# Altium schematic sheet GMSL_SERIALIZER.SchDoc
size C; SheetNumber: 18; SheetTotal: 19
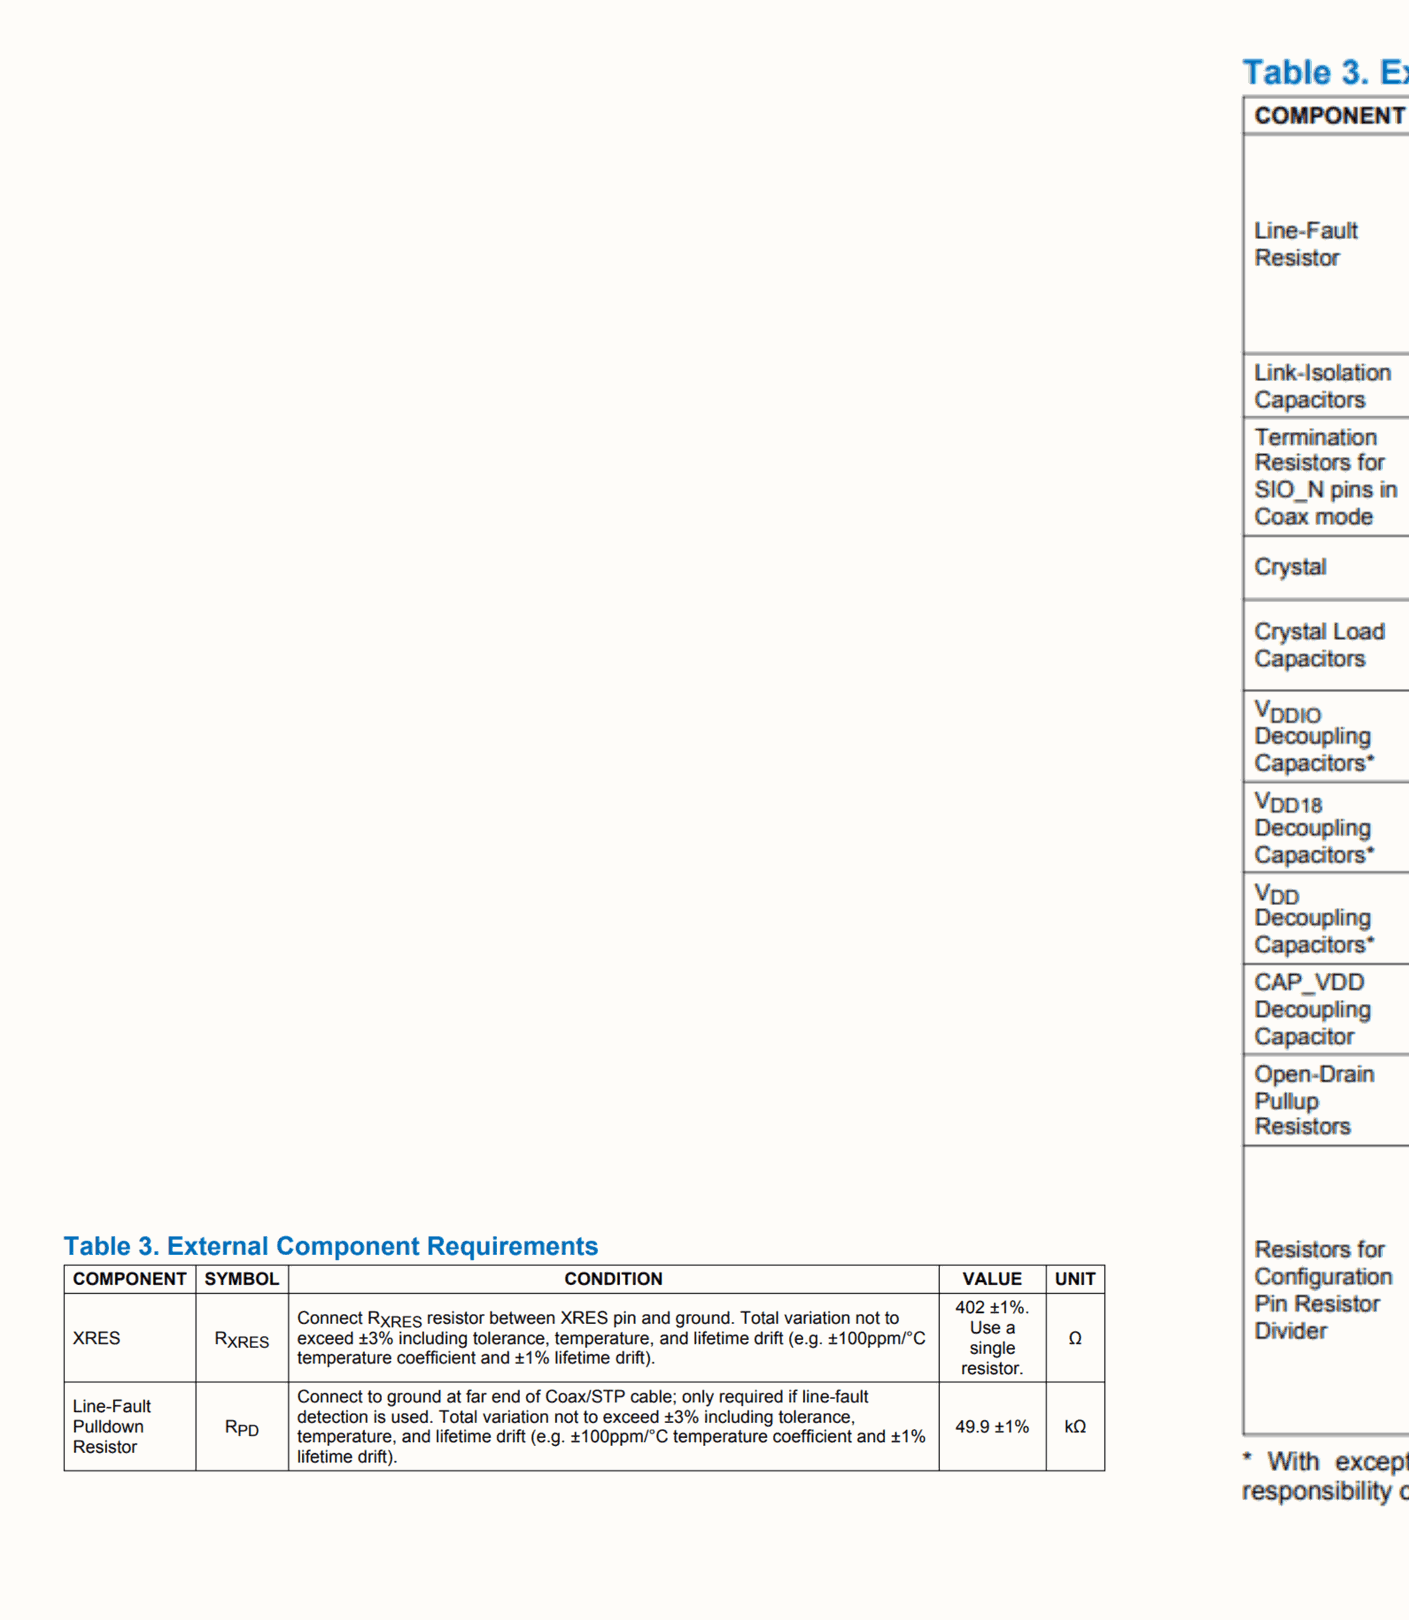
[diagram p0: GMSL_SERIALIZER.SchDoc, top left]
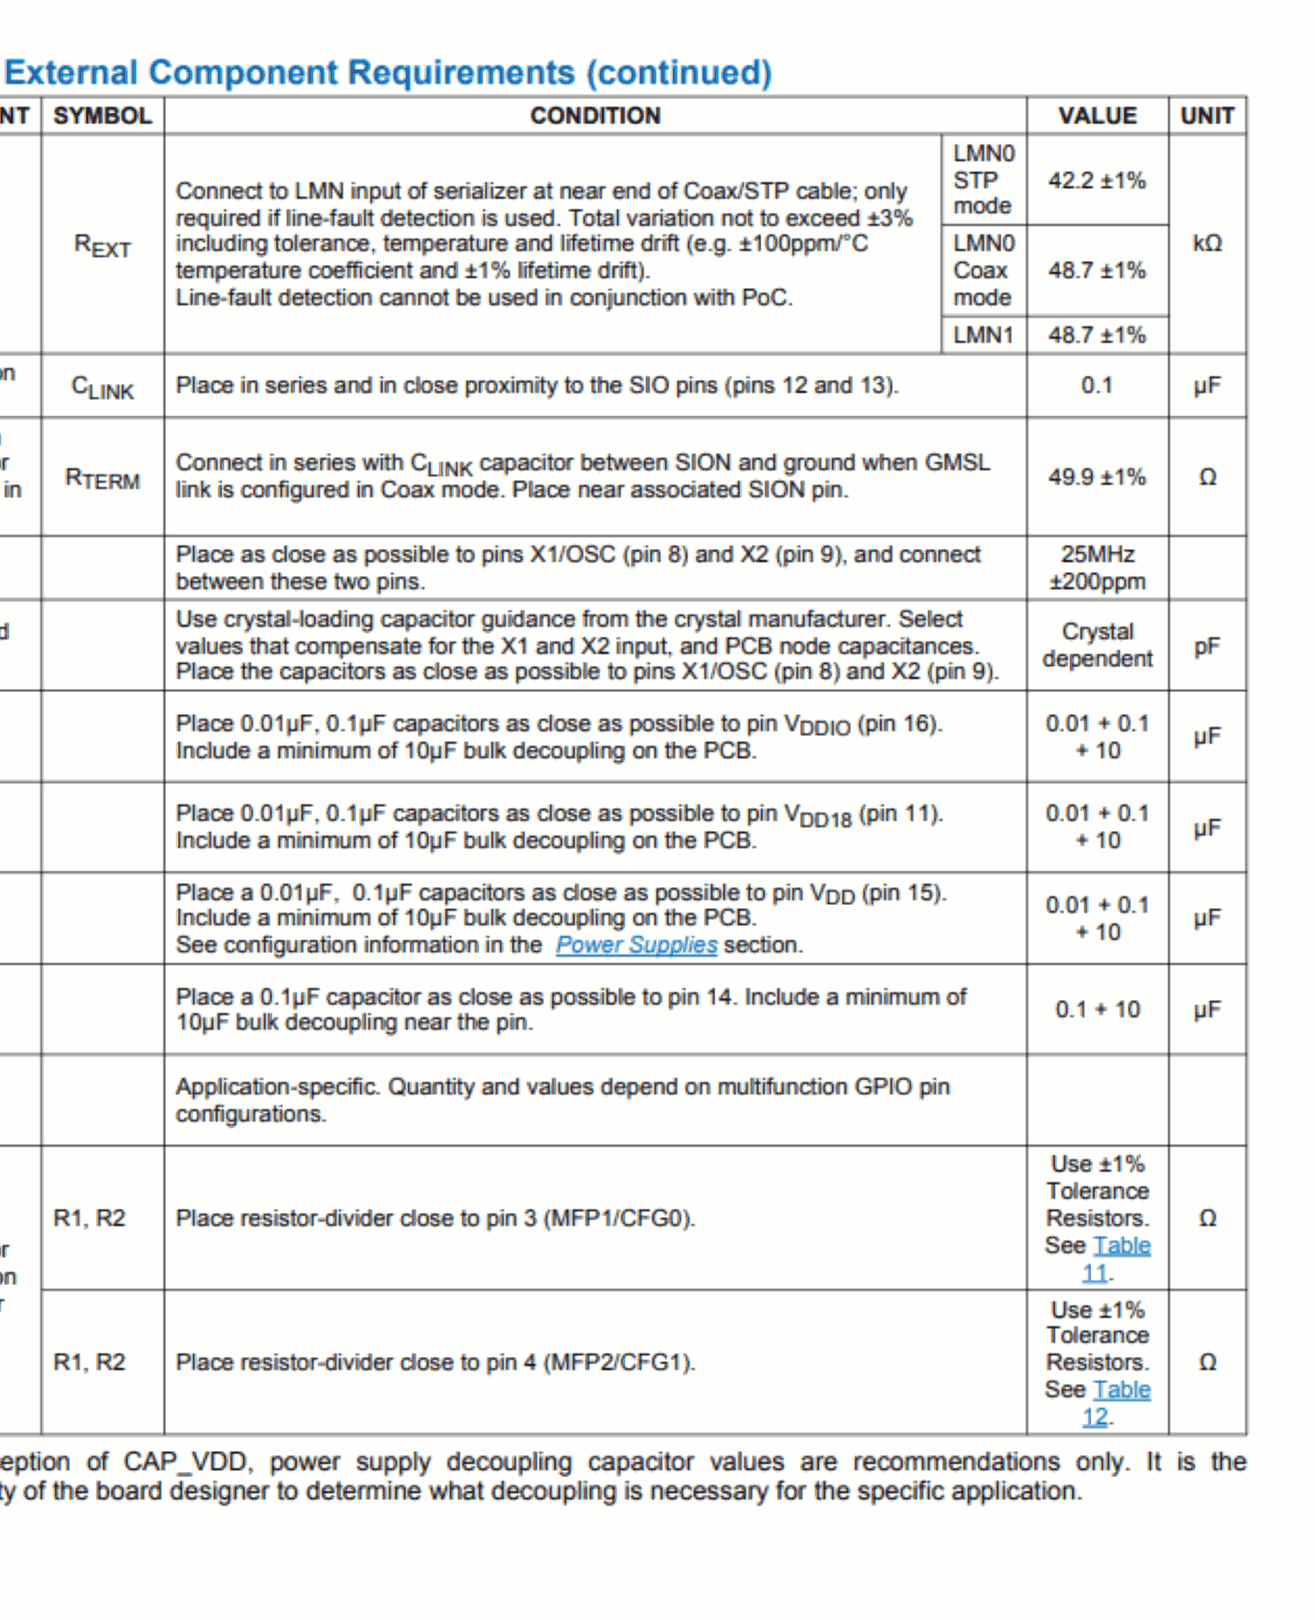
[diagram p1: GMSL_SERIALIZER.SchDoc, top right]
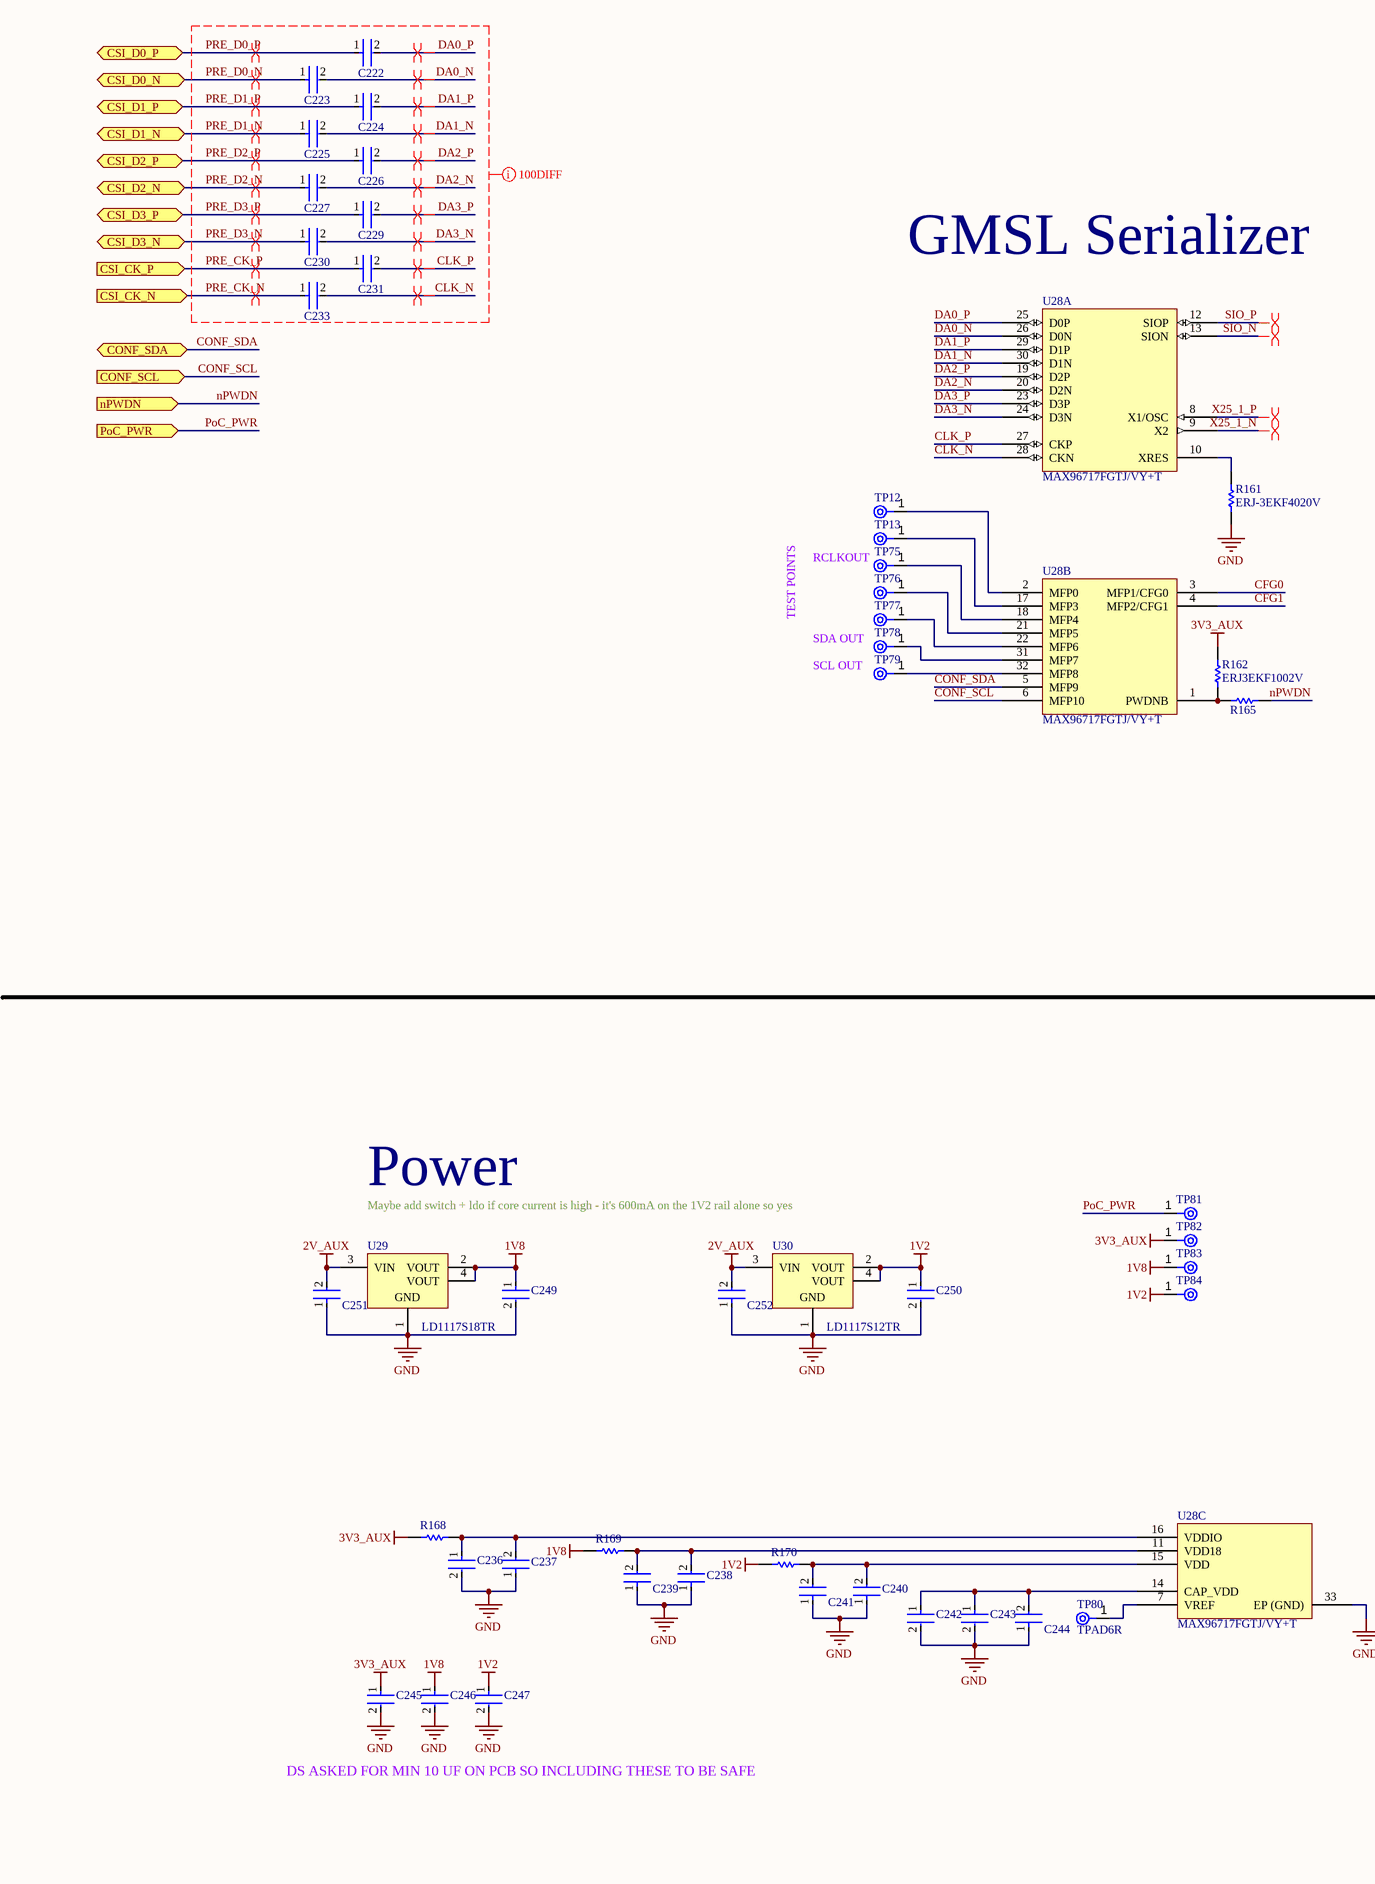
[diagram p2: GMSL_SERIALIZER.SchDoc, bottom left]
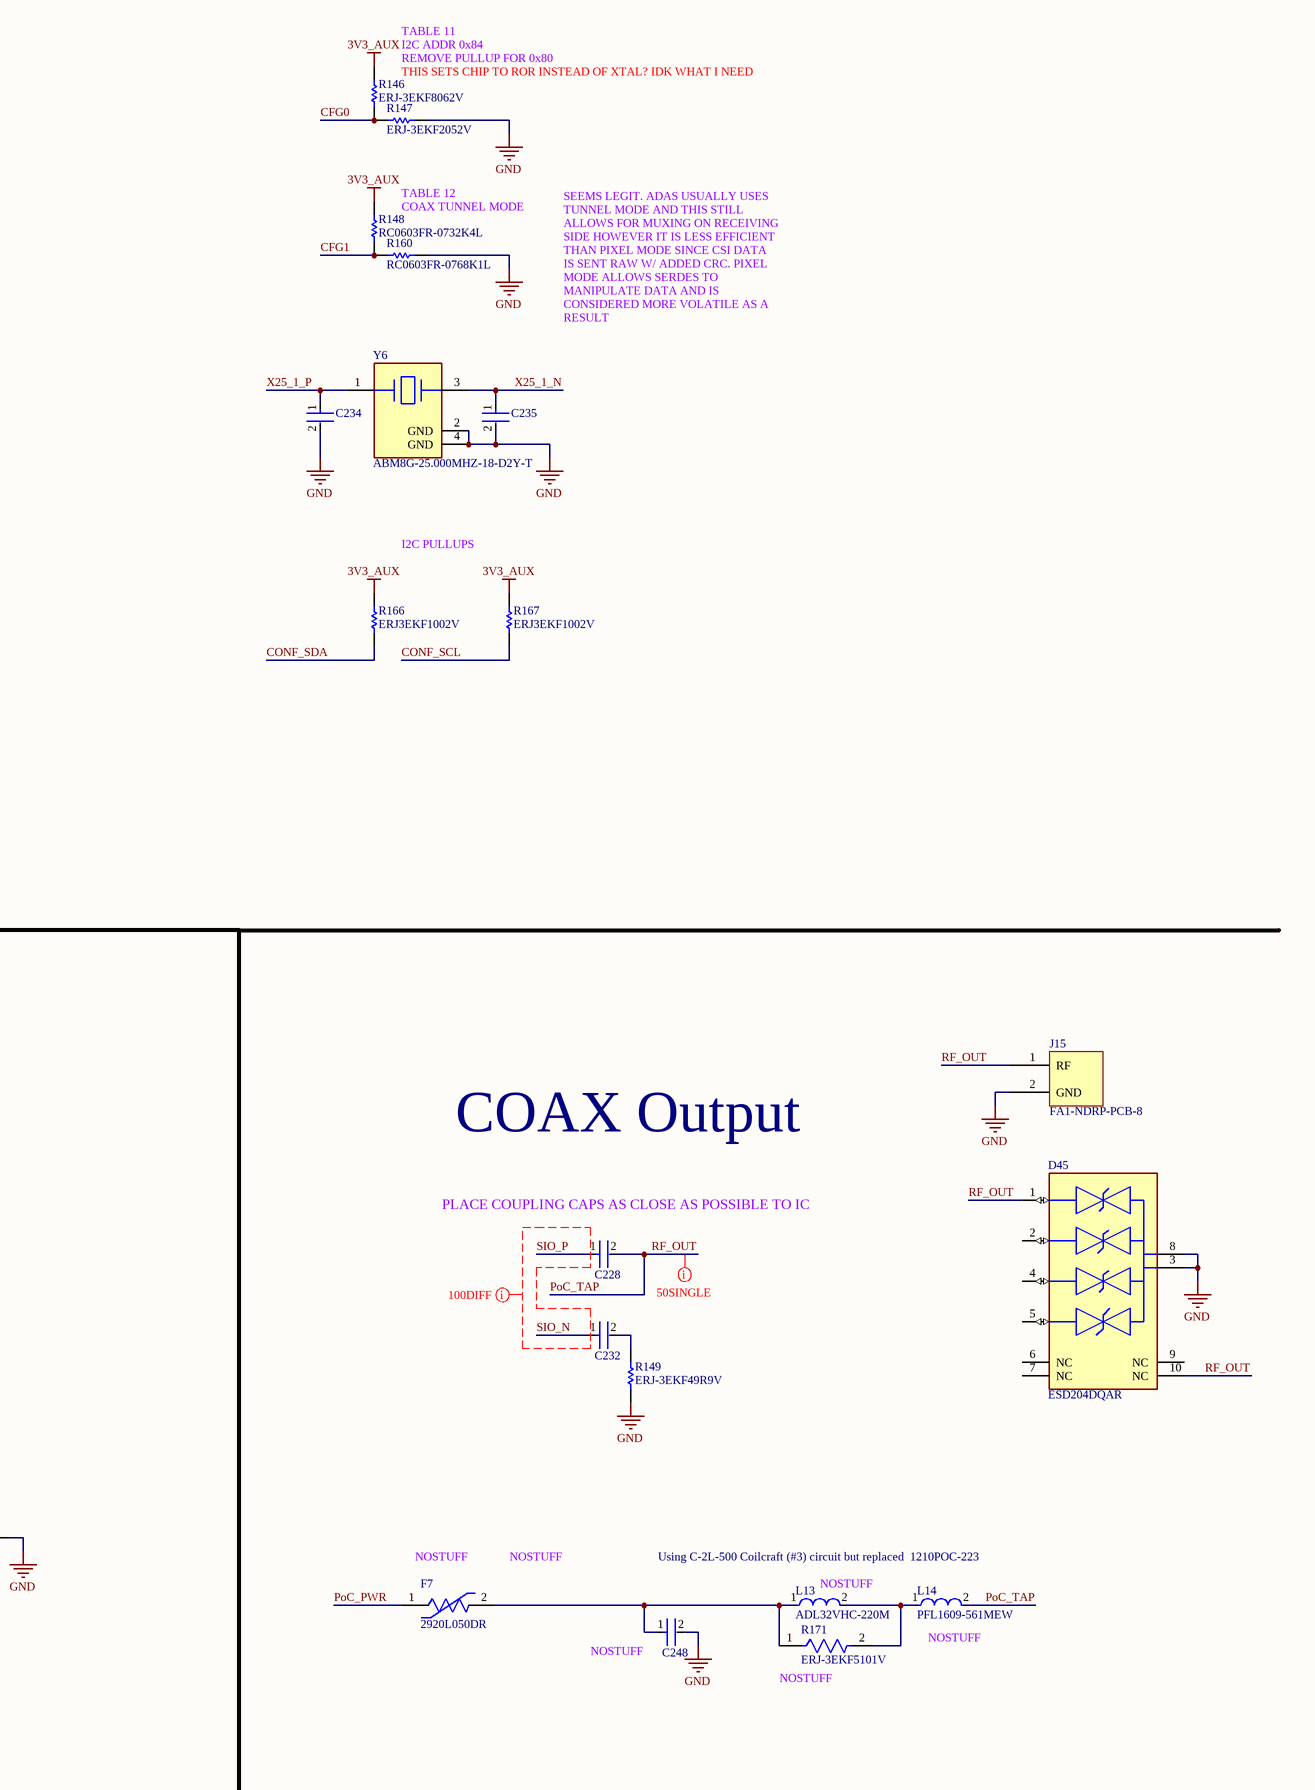
[diagram p3: GMSL_SERIALIZER.SchDoc, bottom right]

## Parts
C222  C1005X7R1H104K050BB  [FP-C1005-050-0_05-IPC_C]  (value not drawn)
C223  C1005X7R1H104K050BB  [FP-C1005-050-0_05-IPC_C]  (value not drawn)
C224  C1005X7R1H104K050BB  [FP-C1005-050-0_05-IPC_C]  (value not drawn)
C225  C1005X7R1H104K050BB  [FP-C1005-050-0_05-IPC_C]  (value not drawn)
C226  C1005X7R1H104K050BB  [FP-C1005-050-0_05-IPC_C]  (value not drawn)
C227  C1005X7R1H104K050BB  [FP-C1005-050-0_05-IPC_C]  (value not drawn)
C228  C1005X7R1H104K050BB  [FP-C1005-050-0_05-IPC_C]  (value not drawn)
C229  C1005X7R1H104K050BB  [FP-C1005-050-0_05-IPC_C]  (value not drawn)
C230  C1005X7R1H104K050BB  [FP-C1005-050-0_05-IPC_C]  (value not drawn)
C231  C1005X7R1H104K050BB  [FP-C1005-050-0_05-IPC_C]  (value not drawn)
C232  C1005X7R1H104K050BB  [FP-C1005-050-0_05-IPC_C]  (value not drawn)
C233  C1005X7R1H104K050BB  [FP-C1005-050-0_05-IPC_C]  (value not drawn)
C234  C0603C300J5GACTU  [FP-C0603C-CF-MFG]  (value not drawn)
C235  C0603C300J5GACTU  [FP-C0603C-CF-MFG]  (value not drawn)
C236  CL05A106MP5NUNC  [FP-CL05A106MP5NUNC-MFG]  (value not drawn)
C237  C0402C103M5RACTU  [FP-C0402-BB-MFG]  (value not drawn)
C238  C0402C103M5RACTU  [FP-C0402-BB-MFG]  (value not drawn)
C239  C1005X7R1H104K050BB  [FP-C1005-050-0_05-IPC_C]  (value not drawn)
C240  C0402C103M5RACTU  [FP-C0402-BB-MFG]  (value not drawn)
C241  C1005X7R1H104K050BB  [FP-C1005-050-0_05-IPC_C]  (value not drawn)
C242  CL05A106MP5NUNC  [FP-CL05A106MP5NUNC-MFG]  (value not drawn)
C243  CL05A106MP5NUNC  [FP-CL05A106MP5NUNC-MFG]  (value not drawn)
C244  C1005X7R1H104K050BB  [FP-C1005-050-0_05-IPC_C]  (value not drawn)
C245  CL05A106MP5NUNC  [FP-CL05A106MP5NUNC-MFG]  (value not drawn)
C246  CL05A106MP5NUNC  [FP-CL05A106MP5NUNC-MFG]  (value not drawn)
C247  CL05A106MP5NUNC  [FP-CL05A106MP5NUNC-MFG]  (value not drawn)
C248  GRM21BR61E226ME44L  [FP-GRM21B-0_2-e0_2_0_7-IPC_B]  (value not drawn)
C249  GRM188R60J106ME47D  [FP-GRM188-0_1-e0_2_0_55-IPC_A]  (value not drawn)
C250  GRM188R60J106ME47D  [FP-GRM188-0_1-e0_2_0_55-IPC_A]  (value not drawn)
C251  C1005X7R1H104K050BB  [FP-C1005-050-0_05-IPC_C]  (value not drawn)
C252  C1005X7R1H104K050BB  [FP-C1005-050-0_05-IPC_C]  (value not drawn)
D45  ESD204DQAR  [FP-DQA0010A-MFG]
F7  2920L050DR  [FP-2920L050DR-MFG]
J15  FA1-NDRP-PCB-8  [FA1-NDRP-PCB-8-Footprint-1]
L13  ADL32VHC-220M  [FP-1210POC-MFG]
L14  PFL1609-561MEW  [FP-PFL1609-MFG]
R146  ERJ-3EKF8062V  [RESC1608X55X30LL15T15]
R147  ERJ-3EKF2052V  [RESC1608X55X30NL15T15]
R148  RC0603FR-0732K4L  [RESC1608X55X25ML10T15]
R149  ERJ-3EKF49R9V  [RESC1608X55X30ML15T15]
R160  RC0603FR-0768K1L  [RESC1608X55X25LL10T15]
R161  ERJ-3EKF4020V  [RESC1608X55X30LL15T15]
R162  ERJ3EKF1002V  [RESC1609X55X30LL15T15]
R165  0402 JUMPER  [RESC1005X40X25ML05T05]  (value not drawn)
R166  ERJ3EKF1002V  [RESC1609X55X30LL15T15]
R167  ERJ3EKF1002V  [RESC1609X55X30LL15T15]
R168  RC0402JR-070RL  [RESC1005X40X25NL05T10]  (value not drawn)
R169  RC0402JR-070RL  [RESC1005X40X25NL05T10]  (value not drawn)
R170  RC0402JR-070RL  [RESC1005X40X25NL05T10]  (value not drawn)
R171  ERJ-3EKF5101V  [FP-ERJ3EK-MFG]
TP12  TPAD6R  [New footprint 1]  (value not drawn)
TP13  TPAD6R  [New footprint 1]  (value not drawn)
TP75  TPAD6R  [New footprint 1]  (value not drawn)
TP76  TPAD6R  [New footprint 1]  (value not drawn)
TP77  TPAD6R  [New footprint 1]  (value not drawn)
TP78  TPAD6R  [New footprint 1]  (value not drawn)
TP79  TPAD6R  [New footprint 1]  (value not drawn)
TP80  TPAD6R  [New footprint 1]
TP81  TPAD6R  [New footprint 1]  (value not drawn)
TP82  TPAD6R  [New footprint 1]  (value not drawn)
TP83  TPAD6R  [New footprint 1]  (value not drawn)
TP84  TPAD6R  [New footprint 1]  (value not drawn)
U28  MAX96717FGTJ/VY+T  [QFN50P500X500X80_HS-33N]  (parts A,B,C of 3)
U29  LD1117S18TR  [SOT-223_M]
U30  LD1117S12TR  [SOT-223_M]
Y6  ABM8G-25.000MHZ-18-D2Y-T  [FP-ABM8G-MFG]

## Ports
CONF_SCL (in, see VISION_BETA_EBB[7B]), CONF_SDA (bidir, see VISION_BETA_EBB[7B]), CSI_CK_N (in, see VISION_BETA_EBB[7B]), CSI_CK_P (in, see VISION_BETA_EBB[7B]), CSI_D0_N (bidir, see VISION_BETA_EBB[7B]), CSI_D0_P (bidir, see VISION_BETA_EBB[7B]), CSI_D1_N (bidir, see VISION_BETA_EBB[7B]), CSI_D1_P (bidir, see VISION_BETA_EBB[7B]), CSI_D2_N (bidir, see VISION_BETA_EBB[7B]), CSI_D2_P (bidir, see VISION_BETA_EBB[7B]), CSI_D3_N (bidir, see VISION_BETA_EBB[7B]), CSI_D3_P (bidir, see VISION_BETA_EBB[7B]), nPWDN (in, see VISION_BETA_EBB[7B]), PoC_PWR (in, see VISION_BETA_EBB[7B], GMSL_DESERIALIZER[1B])

## Nets
1V2: C247.1 C250.1 R170.1 TP84.1(TP) U30.2(VOUT) U30.4(VOUT)
1V8: C246.1 C249.1 R169.1 TP83.1(TP) U29.2(VOUT) U29.4(VOUT)
2V_AUX: C251.2 C252.2 U29.3(VIN) U30.3(VIN)
3V3_AUX: C245.1 R146.2 R148.2 R162.2 R166.2 R167.2 R168.1 TP82.1(TP)
GND: C234.2 C235.2 C236.2 C237.1 C238.1 C239.1 C240.1 C241.1 C242.2 C243.2 C244.1 C245.2 C246.2 C247.2 C248.2 C249.2 C250.2 C251.1 C252.1 D45.3(GND) D45.8(GND) J15.2(GND) R147.1 R149.1 R160.1 R161.1 U28.33(EP_(GND)) U29.1(GND) U30.1(GND) Y6.2(GND) Y6.4(GND)
CFG0: R146.1 R147.2 U28.3(MFP1/CFG0)
CFG1: R148.1 R160.2 U28.4(MFP2/CFG1)
CLK_N: C233.2 U28.28(CKN)
CLK_P: C231.2 U28.27(CKP)
CONF_SCL: R167.1 U28.6(MFP10) ; port CONF_SCL
CONF_SDA: R166.1 U28.5(MFP9) ; port CONF_SDA
DA0_N: C223.2 U28.26(D0N)
DA0_P: C222.2 U28.25(D0P)
DA1_N: C225.2 U28.30(D1N)
DA1_P: C224.2 U28.29(D1P)
DA2_N: C227.2 U28.20(D2N)
DA2_P: C226.2 U28.19(D2P)
DA3_N: C230.2 U28.24(D3N)
DA3_P: C229.2 U28.23(D3P)
nPWDN: R165.2 ; port nPWDN
PoC_PWR: F7.1 TP81.1(TP) ; port PoC_PWR
PoC_TAP: C228.2 D45.1(IO1) D45.10(NC) J15.1(RF) L14.2  [also labelled RF_OUT]
PRE_CK_N: C233.1 ; port CSI_CK_N
PRE_CK_P: C231.1 ; port CSI_CK_P
PRE_D0_N: C223.1 ; port CSI_D0_N
PRE_D0_P: C222.1 ; port CSI_D0_P
PRE_D1_N: C225.1 ; port CSI_D1_N
PRE_D1_P: C224.1 ; port CSI_D1_P
PRE_D2_N: C227.1 ; port CSI_D2_N
PRE_D2_P: C226.1 ; port CSI_D2_P
PRE_D3_N: C230.1 ; port CSI_D3_N
PRE_D3_P: C229.1 ; port CSI_D3_P
SIO_N: C232.1 U28.13(SION)
SIO_P: C228.1 U28.12(SIOP)
X25_1_N: C235.1 U28.9(X2) Y6.3
X25_1_P: C234.1 U28.8(X1/OSC) Y6.1
NetC232_2: C232.2 R149.2
NetC236_1: C236.1 C237.2 R168.2 U28.16(VDDIO)
NetC238_2: C238.2 C239.2 R169.2 U28.11(VDD18)
NetC240_2: C240.2 C241.2 R170.2 U28.15(VDD)
NetC242_1: C242.1 C243.1 C244.2 U28.14(CAP_VDD)
NetC248_1: C248.1 F7.2 L13.1 R171.1
NetL13_2: L13.2 L14.1 R171.2
NetR161_2: R161.2 U28.10(XRES)
NetR162_1: R162.1 R165.1 U28.1(PWDNB)
NetTP12_1: TP12.1(TP) U28.2(MFP0)
NetTP13_1: TP13.1(TP) U28.17(MFP3)
NetTP75_1: TP75.1(TP) U28.18(MFP4)
NetTP76_1: TP76.1(TP) U28.21(MFP5)
NetTP77_1: TP77.1(TP) U28.22(MFP6)
NetTP78_1: TP78.1(TP) U28.31(MFP7)
NetTP79_1: TP79.1(TP) U28.32(MFP8)
NetTP80_1: TP80.1(TP) U28.7(VREF)

Not connected (* = marked no-connect by the designer): D45 2(IO2) 4(IO3) 5(IO4) 6(NC) 7(NC) 9(NC)

## Layout directives
net class 100DIFF: CLK_N, CLK_P, DA0_N, DA0_P, DA1_N, DA1_P, DA2_N, DA2_P, DA3_N, DA3_P, PRE_CK_N, PRE_CK_P, PRE_D0_N, PRE_D0_P, PRE_D1_N, PRE_D1_P, PRE_D2_N, PRE_D2_P, PRE_D3_N, PRE_D3_P, SIO_N, SIO_P
differential pair: PRE_CK_N, PRE_CK_P, PRE_D0_N, PRE_D0_P, PRE_D1_N, PRE_D1_P, PRE_D2_N, PRE_D2_P, PRE_D3_N, PRE_D3_P, SIO_N, SIO_P, X25_1_N, X25_1_P
net class 50SINGLE: PoC_TAP
differential pair; differential pair class 100DIFF: CLK_N, CLK_P, DA0_N, DA0_P, DA1_N, DA1_P, DA2_N, DA2_P, DA3_N, DA3_P

## Notes on the sheet
- (near R146) I2C ADDR 0x84
- (near R146) REMOVE PULLUP FOR 0x80
- THIS SETS CHIP TO ROR INSTEAD OF XTAL? IDK WHAT I NEED
- (near R146) TABLE 11
- GMSL Serializer
- COAX TUNNEL MODE
- (near R148) TABLE 12
- SEEMS LEGIT. ADAS USUALLY USES TUNNEL MODE AND THIS STILL ALLOWS FOR MUXING ON RECEIVING SIDE HOWEVER IT IS LESS EFFICIENT THAN PIXEL MODE SINCE CSI DATA IS SENT RAW W/ ADDED CRC. PIXEL MODE ALLOWS SERDES TO MANIPULATE DATA AND IS CONSIDERED MORE VOLATILE AS A RESULT
- TEST POINTS
- RCLKOUT
- I2C PULLUPS
- SDA OUT
- SCL OUT
- Power
- Maybe add switch + ldo if core current is high - it's 600mA on the 1V2 rail alone so yes
- COAX Output
- (near C228) PLACE COUPLING CAPS AS CLOSE AS POSSIBLE TO IC
- (near F7) NOSTUFF
- NOSTUFF
- Using C-2L-500 Coilcraft (#3) circuit but replaced  1210POC-223
- (near L13) NOSTUFF
- (near C248) NOSTUFF
- (near R171) NOSTUFF
- (near L14) NOSTUFF
- DS ASKED FOR MIN 10 UF ON PCB SO INCLUDING THESE TO BE SAFE

## Library data of the parts
C222-C233 C239 C241 C244 C251 C252 = CMP-2000-05393-2: Multilayer Ceramic Capacitors 100nF ±10% 50V X7R SMD 0402; Voltage: 50V; Dielectric Material: Ceramic; Min Operating Temperature: -55°C; Depth: 0.5mm; Radiation Hardening: No; RoHS Compliant: Yes; Voltage Rating (DC): 50V; Lead Free: Lead Free; Resistor Type: Ceramic; Height: 0.5mm; Dielectric: X7R; Thickness: 0.022inch; Case/Package: 0402; Case Code (Metric): 1005; Termination: SMD/SMT; Capacitance: 100nF; Packaging: Tape and Reel; Max Operating Temperature: 125°C; Mount: Surface Mount; Package Quantity: 1; Width: 0.02inch; Weight: 2.3E-05oz; Voltage Rating: 50V; Tolerance: 10%; Construction: Flat; Case Code (Imperial): 0402; Length: 1mm; REACH SVHC: No SVHC; Series: C
C234 C235 = CMP-1035-00914-3: CAP CER 30PF 50V 5% NP0 0603; Manufacturer: KEMET; Automotive Grade: Grade 1; Temperature Coefficient: 30ppm/°C; Material: Ceramic; Temperature Characteristic: C0G; Tolerance: 0.05; Manufacturer Part Number: C0603C300J5GACTU; ComponentLink2URL: https://api.kemet.com/component-edge/download/datasheet/C0603C100J5GACAUTO.pdf; Automotive: Yes; Device Class L2: Capacitors; Device Class L1: Passive Components; Device Class L3: Ceramic Capacitors; RoHS: TRUE; Octopart: https://octopart.com/c0603c300j5gactu-kemet-199455; Lead Free: Yes; Value: 30 pF; Temperature Range High: +125°C; Category: Cap; Temperature: -55°C to +125°C; Package: C0603C-CF; Capacitance: 30 pF; Digikey Description: CAP CER 30PF 50V 5% NP0 0603; Height: 0.87mm; ComponentLink2Description: Datasheet; Temperature Range Low: -55°C; Mouser Description: Multilayer Ceramic Capacitors MLCC - SMD/SMT 50volts 30pF C0G 5%; Voltage Rating: 50 V
C236 C242 C243 C245-C247 = CMP-13271-000002-1: CAP CER 10UF 10V X5R 0402; Manufacturer: Samsung; Temperature Coefficient: 15%; Tolerance: 20%; Material: Ceramic; Octopart: https://octopart.com/cl05a106mp5nunc-samsung-22457395; Voltage Rating: 10V; RoHS: TRUE; Value: 10uF; Height: 0.7mm; Digikey Description: CAP CER 10UF 10V X5R 0402; Automotive: No; Package: CL05A106MP5NUNC; Device Class L1: Passive Components; Capacitance: 10uF; Temperature Range High: +85°C; ComponentLink2Description: Datasheet; Device Class L2: Capacitors; Temperature Characteristic: X5R; Manufacturer Part Number: CL05A106MP5NUNC; Temperature: -55°C to +85°C; ComponentLink2URL: http://www.samsungsem.com/kr/support/product-search/mlcc/__icsFiles/afieldfile/2019/05/10/19-CL05A106MP5NUNC.pdf; Device Class L3: Ceramic Capacitors; Category: Cap; Temperature Range Low: -55°C; Ipc Land Pattern Name: CAPC10050X50; Lead Free: Yes
C237 C238 C240 = CMP-1034-01887-3: CAP CER 10000PF 50V 20% X7R 0402; Manufacturer: Kemet; Value: 10,000 pF; Tolerance: 0.2; Temperature Coefficient: 15%; Material: Ceramic; Temperature Range Low: -55°C; Digikey Description: CAP CER 10000PF 50V 20% X7R 0402; Temperature Characteristic: X7R; Device Class L2: Capacitors; RoHS: TRUE; Temperature Range High: +125°C; Mouser Description: Cap Ceramic 0.01uF 50V X7R 20% SMD 1.0 x 0.5 mm 125 C Paper T/R; Package: C0402-BB; ComponentLink2URL: https://content.kemet.com/datasheets/KEM_C1002_X7R_SMD.pdf; Device Class L1: Passive Components; ComponentLink2Description: Datasheet; Height: 0.55mm; Automotive: No; Temperature: -55°C to +125°C; Capacitance: 10,000 pF; Manufacturer Part Number: C0402C103M5RACTU; Device Class L3: Ceramic Capacitors; Voltage Rating: 50 V; Ipc Land Pattern Name: CAPC10050X50; Category: Cap; Octopart: https://octopart.com/c0402c103m5ractu-kemet-17125571; Lead Free: Yes
C248 = CMP-2007-03222-3: Chip Multilayer Ceramic Capacitors for General Purpose, 0805, 22uF, X5R, 15%, 20%, 25V; Case/Package: 0805; Depth: 1.25mm; Resistor Type: Ceramic; Voltage Rating: 25V; Lead Free: Lead Free; Voltage Rating (DC): 25V; Case Code (Metric): 2012; Thickness: 0.057inch; REACH SVHC: No SVHC; Material: Ceramic; Tolerance: 20%; Length: 2mm; Capacitance: 22uF; Case Code (Imperial): 0805; Max Operating Temperature: 85°C; Termination: SMD/SMT; Weight: 0.000335oz; Dielectric: X5R; Packaging: Tape and Reel; Voltage: 25V; Package Quantity: 3000; Height: 1.25mm; Mount: Surface Mount; Width: 1.25mm; Min Operating Temperature: -55°C
C249 C250 = CMP-2006-02792-2: Chip Multilayer Ceramic Capacitors for General Purpose, 0603, 10uF, X5R, 15%, 20%, 6.3V; Packaging: Tape and Reel; Voltage Rating (DC): 6.3V; Width: 0.031inch; Termination: SMD/SMT; Dielectric: X5R; Package Quantity: 4000; Voltage Rating: 6.3V; Capacitance: 10uF; Case/Package: 0603; Min Operating Temperature: -55°C; Voltage: 6.3V; Length: 1.6mm; Thickness: 0.035inch; Lead Free: Lead Free; Depth: 0.8mm; Case Code (Imperial): 0603; Max Operating Temperature: 85°C; Material: Ceramic; Height: 0.8mm; Tolerance: 20%; Mount: Surface Mount; REACH SVHC: No SVHC; Radiation Hardening: No; Case Code (Metric): 1608
D45 = CMP-04989-000002-1: 4-CHANNEL LOW-CAPACITANCE SURGE; Manufacturer: Texas Instruments; Value: 0.55pF; Reverse Standoff Voltage: 3.6V; Standoff Height: 0mm; Breakdown Voltage: 5.5V; Peak Pulse Current: 5.5A; Clamping Voltage: 11.5V; Direction: Bidirectional; Peak Pulse Power: 50W; Number Of Channels: 4; Ambient Temperature Range High: +125°C; ComponentLink2Description: Datasheet; Height: 0.55mm; Lead Free: Yes; Device Class L3: unset; Temperature Range High: +125°C; Temperature Range Low: -40°C; Package: DQA0010A; Temperature: -40°C to +125°C; Capacitance: 0.55pF; RoHS: TRUE; Mouser Description: 4-Channel Low-Capacitance Surge and ESD Protection Diode 10-USON -40 to 125; Category: Diode; Device Class L1: Circuit Protection; Octopart: https://octopart.com/esd204dqar-texas+instruments-89917476; Device Class L2: TVS Diodes; Ambient Temperature Range Low: -40°C; Manufacturer Part Number: ESD204DQAR; ComponentLink2URL: http://www.ti.com/lit/ds/symlink/esd204.pdf; Automotive: No; Digikey Description: 4-CHANNEL LOW-CAPACITANCE SURGE
F7 = CMP-08606-000071-1: PTC RESET FUSE 60V 500MA 2920; Resistance: 1.4R; Trip Current: 1A; Power Dissipation: 1.5W; Time to Trip: 4s; Approvals: cULus; Current Rating: 10A; Operating Supply Voltage: 60V; Termination: SMD/SMT; Width: 5.44mm; Case/Package: 2920; Series: 2920L; Case Code (Imperial): 2920; Height: 1.25mm; Hold Current: 500mA; Terminal Material: Copper; Min Operating Temperature: -40°C; Package Quantity: 1500; Max Voltage Rating (DC): 60V; RoHS Compliant: Yes; Case Code (Metric): 7351; Lead Free: Lead Free; Max Operating Temperature: 85°C; Voltage Rating (DC): 60V; Working Voltage: 60V; Length: 7.98mm; REACH SVHC: No SVHC; Max Current Rating: 10A; Voltage Rating: 60V; Packaging: Tape and Reel
J15 = CMP-002-00054-1: RF F Connector, Male, Board Mount, Solder Terminal, Plug; Connector Type: RF F CONNECTOR; RoHS Compliant: Yes; Mounting Technology: Board
L13 = CMP-11268-000041-1: NOT COILCRAFT - ACTUAL P# --> ADL32VHC-220M / - Power Injection Chokes for PoC; Manufacturer Part Number: 1210POC-223MRC; Value: 22uH; Core Material: Ferrite; Saturation Current: 720mA; Series Resistance: 0.88Ω; Rms Current: 700mA; Automotive Grade: Grade 1; Self Resonant Frequency: 70MHz; Test Frequency: 100kHz; Tolerance: 20%; Ambient Temperature Range High: +125°C; Manufacturer: coilcraft; Octopart: https://octopart.com/1210poc-223mrc-coilcraft-103207315; Category: Ind; Device Class L2: Inductors; RoHS: TRUE; Device Class L3: Fixed Inductors; Package: 1210POC; Ambient Temperature Range Low: -40°C; ComponentLink2URL: https://drive.google.com/open?id=15FlOq8Y4YbRFohfA_cJ40jgnqs8va2Mh; Lead Free: Yes; Inductance: 22uH; Device Class L1: Passive Components; ComponentLink2Description: Datasheet; Automotive: Yes; Height: 3mm
L14 = CMP-11268-000007-1: Fixed Inductors PFL1609 Low Profile 0.56 uH 20 % 1.4 A; Manufacturer: coilcraft; Rms Current: 1100mA; Self Resonant Frequency: 600MHz; Core Material: Composite; Tolerance: 20%; Value: 0.56uH; Automotive Grade: Grade 1; Saturation Current: 710mA; Test Frequency: 7.9MHz; Shielding: true; Series Resistance: 130mΩ; Lead Free: Yes; Device Class L1: Passive Components; Package: PFL1609; Octopart: https://octopart.com/pfl1609-561mew-coilcraft-20329171; ComponentLink2URL: https://www.coilcraft.com/pdfs/pfl1609.pdf; Manufacturer Part Number: PFL1609-561MEW; Ambient Temperature Range Low: -40°C; Composition: Wirewound; Inductance: 0.56uH; Device Class L2: Inductors; Category: Ind; Device Class L3: Fixed Inductors; Mouser Description: Fixed Inductors PFL1609 Low Profile 0.56 uH 20 % 1.4 A; Automotive: Yes; ComponentLink2Description: Datasheet; Ambient Temperature Range High: +105°C; Height: 0.95mm; RoHS: TRUE
R146 = CMP-2000-00651-1: Manufacturer: Panasonic; Part Number: ERJ-3EKF8062V
R147 = CMP-2000-00323-1: Manufacturer: Panasonic; Part Number: ERJ-3EKF2052V
R148 = CMP-2000-04011-1: Manufacturer: Yageo; Part Number: RC0603FR-0732K4L
R149 = CMP-2000-00538-1: Manufacturer: Panasonic; Part Number: ERJ-3EKF49R9V
R160 = CMP-2000-04112-1: Manufacturer: Yageo; Part Number: RC0603FR-0768K1L
R161 = CMP-2000-00484-1: Manufacturer: Panasonic; Part Number: ERJ-3EKF4020V
R162 R166 R167 = CMP-1012-00623-3: Chip Resistor, 10 KOhm, +/- 1%, 0.1 W, -55 to 155 degC, 0603 (1608 Metric), RoHS, Tape and Reel; Manufacturer: Panasonic; Voltage Rating: 75V; Case\/Package: 0603; Power Rating: 100mW; Resistance: 10KOhm; Temperature Coefficient: 100ppm\/degreesC; Number of Pins: 2; Package Reference: 603; Depth: 0.8mm; Mount: SurfaceMount; Package Description: 2-Pin Surface Mount Device, Body 1.6 x 0.85 mm; Datasheet Version: 02/2017; Length: 1.6mm; Lead Free: LeadFree; Height: 0.45mm; Number of Terminations: 2; Max Power Dissipation: 100mW; Min Operating Temperature: -55degC; Datasheet URL: https://industrial.panasonic.com/cdbs/www-data/pdf/RDA0000/AOA0000C304.pdf; Termination: SMD/SMT; Case Code (Metric): 1608; Case Code (Imperial): 0603; Tolerance: 1%; Max Operating Temperature: 155degC; RoHSCompliant: true; Voltage Rating (DC): 75V; Radiation Hardening: No; Packaging: TapeandReel; Composition: ThickFilm; Mounting Technology: SurfaceMount; Manufacturer URL: http://www.panasonic.com/; Width: 0.031inch; REACH SVHC: NoSVHC; Contact Plating: Tin; Military Standard: Not; Package Quantity: 1
R165 = CMP-009-00118-2: READ THE NAME; Pins: 2; Component Type: Standard; Design Item ID: CMP-009-00206-2; Source: 0402jump.SchLib
R168-R170 = CMP-1011-00001-2: Manufacturer: Yageo / Phycomp; Part Number: RC0402JR-070RL
R171 = CMP-2000-00540-8: RES SMD 5.1K OHM 1% 1/10W 0603; Power Rating: 100mW; Temperature Coefficient: 100ppm/°C; Voltage Rating: 75V; Resistance: 5.1kR; Military Standard: Not; Case/Package: 0603; Packaging: Tape and Reel; Package Quantity: 1; Reach SVHC Compliant: Yes; Lead Free: Lead Free; Mount: Surface Mount; Size Code: 0603; Depth: 0.8mm; Resistance Tolerance: 1%; Number of Terminations: 2; Resistor Type: Thick Film; Width: 0.8mm; Construction: Rectangular; Series: ERJ; Radiation Hardening: No; Max Operating Temperature: 155°C; Features: Automotive AEC-Q200; Tolerance: 1%; Voltage Rating (DC): 75V; Length: 1.6mm; RoHS Compliant: Yes; Min Operating Temperature: -55°C; Case Code (Metric): 1608; Termination: SMD/SMT; Weight: 7.1E-05oz; Max Power Dissipation: 100mW; Contact Plating: Tin; Height: 0.022inch; Case Code (Imperial): 0603
TP12 TP13 TP75-TP84 = CMP-00025-2: Test Point .6mm
U28 = CMP-015-00012-1: 3Gbps Serializer TQFN-32 Serializers / Deserializers ROHS
U29 = CMP-0244-00308-1: Fixed Low Drop Positive Voltage Regulator, 1.8V, 4-Pin SOT-223, Tape and Reel; ComponentLink1URL: http://www.st.com; PackageReference: SOT-223; PackageDescription: 4-Pin SOT-223 Package, 6.5 x 3.5 mm Body, 2.3 mm Pitch, 7 mm Lead Span; ComponentLink2URL: http://www.st.com/internet/com/TECHNICAL_RESOURCES/TECHNICAL_LITERATURE/DATASHEET/CD00000544.pdf; ComponentLink2Description: Datasheet; ComponentLink1Description: Manufacturer URL; DatasheetVersion: 1/11/2011; PackageVersion: 2010
U30 = CMP-0244-00318-1: Fixed Low Drop Positive Voltage Regulator, 1.2V, 4-Pin SOT-223, Tape and Reel; PackageDescription: 4-Pin SOT-223 Package, 6.5 x 3.5 mm Body, 2.3 mm Pitch, 7 mm Lead Span; PackageVersion: 2010; ComponentLink2Description: Datasheet; PackageReference: SOT-223; ComponentLink2URL: http://www.st.com/internet/com/TECHNICAL_RESOURCES/TECHNICAL_LITERATURE/DATASHEET/CD00000544.pdf; ComponentLink1Description: Manufacturer URL; DatasheetVersion: 1/11/2011; ComponentLink1URL: http://www.st.com
Y6 = CMP-2000-05733-3: Crystal 25MHz ±20ppm (Tol) ±30ppm (Stability) 18pF FUND 60Ω 4-Pin SMD T/R; Series Resistance: 60R; Length: 3.2mm; Depth: 2.5mm; Packaging: Tape and Reel; Min Operating Temperature: -40°C; Operating Frequency: 25 MHz; Lead Free: Lead Free; Number of Pins: 4; Frequency Tolerance: 20ppm; Radiation Hardening: No; Max Operating Temperature: 85°C; Termination: SMD/SMT; Frequency Stability: 30ppm; Frequency: 25MHz; Series: ABM8G; Mount: Surface Mount; Package Quantity: 1000; Height: 0.039inch; Width: 0.098inch; Case/Package: CSMD; ESR (Equivalent Series Resistance): 60R; Load Capacitance: 18pF; Tolerance: 20ppm